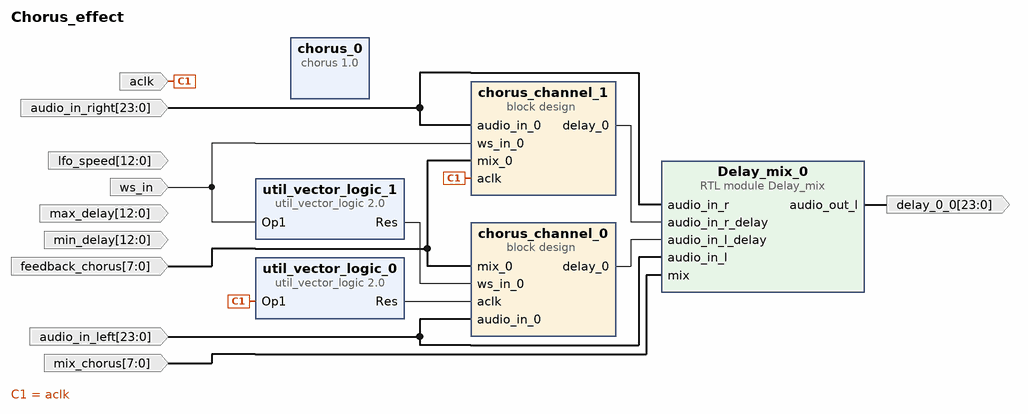
[diagram p0: block diagram of the top level]
# Vivado block design Chorus_effect, xc7a100tcsg324-1, Vivado 2022.2
create_bd_design Chorus_effect

create_bd_port -dir I -type clk aclk
set_property -dict {CONFIG.FREQ_HZ 11289000} [get_bd_ports aclk]
create_bd_port -dir I -type clk ws_in
set_property -dict {CONFIG.FREQ_HZ 44000} [get_bd_ports ws_in]
create_bd_port -dir I -from 23 -to 0 audio_in_left
create_bd_port -dir O -from 23 -to 0 delay_0_0
create_bd_port -dir I -from 23 -to 0 audio_in_right
create_bd_port -dir I -from 12 -to 0 lfo_speed
create_bd_port -dir I -from 12 -to 0 max_delay
create_bd_port -dir I -from 12 -to 0 min_delay
create_bd_port -dir I -from 7 -to 0 feedback_chorus
create_bd_port -dir I -from 7 -to 0 mix_chorus

create_bd_cell -type ip -vlnv xilinx.com:ip:util_vector_logic:2.0 util_vector_logic_0
set_property -dict {CONFIG.C_OPERATION not CONFIG.C_SIZE 1} [get_bd_cells util_vector_logic_0]
create_bd_cell -type ip -vlnv xilinx.com:ip:util_vector_logic:2.0 util_vector_logic_1
set_property -dict {CONFIG.C_OPERATION not CONFIG.C_SIZE 1} [get_bd_cells util_vector_logic_1]
create_bd_cell -type container -reference chorus_channel chorus_channel_0
set_property -dict [list \
  CONFIG.ACTIVE_SIM_BD chorus_channel.bd \
  CONFIG.ACTIVE_SYNTH_BD chorus_channel.bd \
  CONFIG.ENABLE_DFX 0 \
  CONFIG.LIST_SIM_BD chorus_channel.bd \
  CONFIG.LIST_SYNTH_BD chorus_channel.bd \
  CONFIG.LOCK_PROPAGATE 0 \
] [get_bd_cells chorus_channel_0]
create_bd_cell -type module -reference Delay_mix Delay_mix_0
create_bd_cell -type container -reference chorus_channel chorus_channel_1
set_property -dict [list \
  CONFIG.ACTIVE_SIM_BD chorus_channel.bd \
  CONFIG.ACTIVE_SYNTH_BD chorus_channel.bd \
  CONFIG.ENABLE_DFX 0 \
  CONFIG.LIST_SIM_BD chorus_channel.bd \
  CONFIG.LIST_SYNTH_BD chorus_channel.bd \
  CONFIG.LOCK_PROPAGATE 0 \
] [get_bd_cells chorus_channel_1]
create_bd_cell -type ip -vlnv xilinx.com:user:chorus:1.0 chorus_0

# ---- connections ----

connect_bd_net [get_bd_pins Delay_mix_0/audio_out_l] [get_bd_ports delay_0_0]
connect_bd_net [get_bd_ports aclk] [get_bd_pins util_vector_logic_0/Op1] [get_bd_pins chorus_channel_1/aclk]
connect_bd_net -net aclk_2 [get_bd_pins util_vector_logic_0/Res] [get_bd_pins chorus_channel_0/aclk]
connect_bd_net -net audio_in_0_0_1 [get_bd_ports audio_in_left] [get_bd_pins chorus_channel_0/audio_in_0] [get_bd_pins Delay_mix_0/audio_in_l]
connect_bd_net -net audio_in_0_0_2 [get_bd_ports audio_in_right] [get_bd_pins chorus_channel_1/audio_in_0] [get_bd_pins Delay_mix_0/audio_in_r]
connect_bd_net [get_bd_pins chorus_channel_0/delay_0] [get_bd_pins Delay_mix_0/audio_in_l_delay]
connect_bd_net [get_bd_pins chorus_channel_1/delay_0] [get_bd_pins Delay_mix_0/audio_in_r_delay]
# net lfo_speed_0_0_1 has one end: lfo_speed
# net max_delay_0_0_1 has one end: max_delay
# net min_delay_0_0_1 has one end: min_delay
connect_bd_net -net mix_0_0_1 [get_bd_ports feedback_chorus] [get_bd_pins chorus_channel_1/mix_0] [get_bd_pins chorus_channel_0/mix_0]
connect_bd_net -net mix_0_1 [get_bd_ports mix_chorus] [get_bd_pins Delay_mix_0/mix]
connect_bd_net -net ws_in_0_1 [get_bd_pins util_vector_logic_1/Res] [get_bd_pins chorus_channel_0/ws_in_0]
connect_bd_net [get_bd_ports ws_in] [get_bd_pins util_vector_logic_1/Op1] [get_bd_pins chorus_channel_1/ws_in_0]

validate_bd_design
save_bd_design
